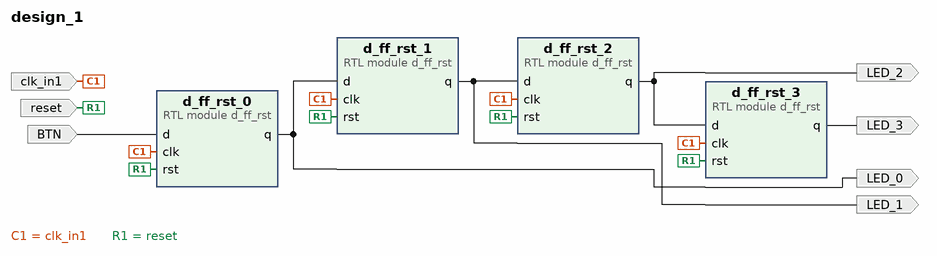
[diagram p0: block diagram of the top level]
# Vivado block design design_1, xc7a50ticsg324-1L, Vivado 2021.2
create_bd_design design_1

create_bd_port -dir O LED_0
create_bd_port -dir O LED_1
create_bd_port -dir O LED_2
create_bd_port -dir O LED_3
create_bd_port -dir I BTN
create_bd_port -dir I -type clk clk_in1
set_property -dict {CONFIG.FREQ_HZ 100000000} [get_bd_ports clk_in1]
create_bd_port -dir I -type rst reset
set_property -dict {CONFIG.POLARITY ACTIVE_LOW} [get_bd_ports reset]

create_bd_cell -type module -reference d_ff_rst d_ff_rst_0
create_bd_cell -type module -reference d_ff_rst d_ff_rst_1
create_bd_cell -type module -reference d_ff_rst d_ff_rst_2
create_bd_cell -type module -reference d_ff_rst d_ff_rst_3

# ---- connections ----

connect_bd_net [get_bd_ports BTN] [get_bd_pins d_ff_rst_0/d]
connect_bd_net -net Clk [get_bd_ports clk_in1] \
  [get_bd_pins d_ff_rst_1/clk] [get_bd_pins d_ff_rst_0/clk] [get_bd_pins d_ff_rst_2/clk] [get_bd_pins d_ff_rst_3/clk]
connect_bd_net [get_bd_pins d_ff_rst_0/q] [get_bd_pins d_ff_rst_1/d] [get_bd_ports LED_0]
connect_bd_net [get_bd_pins d_ff_rst_1/q] [get_bd_pins d_ff_rst_2/d] [get_bd_ports LED_1]
connect_bd_net [get_bd_pins d_ff_rst_2/q] [get_bd_pins d_ff_rst_3/d] [get_bd_ports LED_2]
connect_bd_net [get_bd_pins d_ff_rst_3/q] [get_bd_ports LED_3]
connect_bd_net -net rst_clk_wiz_100M_peripheral_aresetn [get_bd_ports reset] \
  [get_bd_pins d_ff_rst_0/rst] [get_bd_pins d_ff_rst_1/rst] [get_bd_pins d_ff_rst_2/rst] [get_bd_pins d_ff_rst_3/rst]

validate_bd_design
save_bd_design
